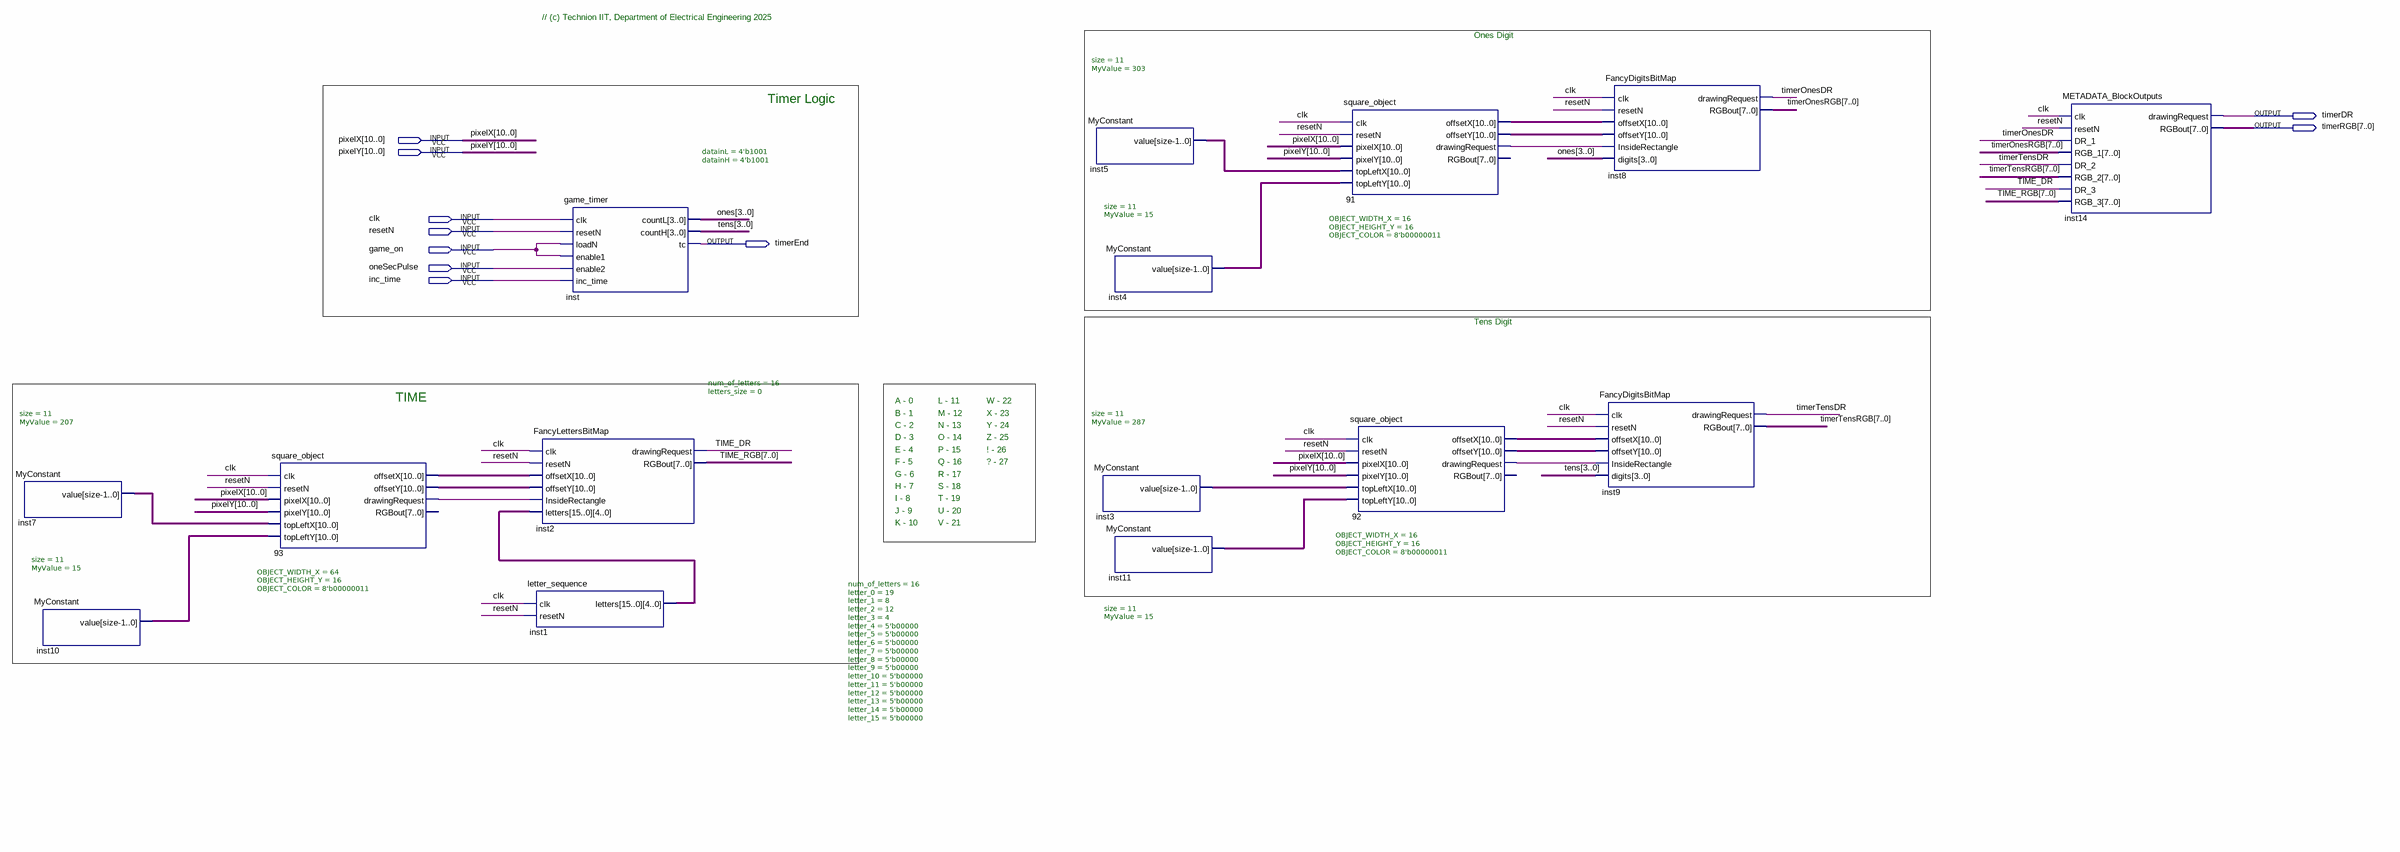
[diagram p0: schematic sheet]
// Quartus schematic Timer_Block.bdf as structural Verilog: 15 symbols, 10 pins
module Timer_Block (
  input  [10:0] pixelX,
  input  [10:0] pixelY,
  input  clk,
  input  resetN,
  input  game_on,
  input  oneSecPulse,
  input  inc_time,
  output timerDR,
  output [7:0] timerRGB,
  output timerEnd
);

  wire n91_drawingrequest, n92_drawingrequest, n93_drawingrequest, TIME_DR, timerOnesDR, timerTensDR;
  wire [3:0] ones, tens;
  wire [7:0] TIME_RGB, timerOnesRGB, timerTensRGB;
  wire [10:0] inst3_value, inst4_value, inst5_value, inst7_value, inst10_value, inst11_value, n91_offsetx,
       n91_offsety, n92_offsetx, n92_offsety, n93_offsetx, n93_offsety;
  wire [79:0] inst1_letters;

  MyConstant #(.size(11), .MyValue(207)) inst7 (.value(inst7_value));
  MyConstant #(.size(11), .MyValue(15)) inst10 (.value(inst10_value));
  square_object #(.OBJECT_WIDTH_X(64), .OBJECT_HEIGHT_Y(16), .OBJECT_COLOR(8'b00000011)) u_93 (
    .clk(clk), .resetN(resetN), .pixelX(pixelX), .pixelY(pixelY), .topLeftX(inst7_value),
    .topLeftY(inst10_value), .offsetX(n93_offsetx), .offsetY(n93_offsety), .drawingRequest(n93_drawingrequest));  // open: RGBout
  FancyLettersBitMap #(.num_of_letters(16), .letters_size(0)) inst2 (
    .clk(clk), .resetN(resetN), .offsetX(n93_offsetx), .offsetY(n93_offsety),
    .InsideRectangle(n93_drawingrequest), .letters(inst1_letters), .drawingRequest(TIME_DR), .RGBout(TIME_RGB));
  letter_sequence #(.num_of_letters(16), .letter_0(19), .letter_1(8), .letter_2(12), .letter_3(4), .letter_4(5'b00000), .letter_5(5'b00000), .letter_6(5'b00000), .letter_7(5'b00000), .letter_8(5'b00000), .letter_9(5'b00000), .letter_10(5'b00000), .letter_11(5'b00000), .letter_12(5'b00000), .letter_13(5'b00000), .letter_14(5'b00000), .letter_15(5'b00000)) inst1 (
    .clk(clk), .resetN(resetN), .letters(inst1_letters));
  game_timer #(.datainL(4'b1001), .datainH(4'b1001)) inst (
    .clk(clk), .resetN(resetN), .loadN(game_on), .enable1(game_on), .enable2(oneSecPulse),
    .inc_time(inc_time), .countL(ones), .countH(tens), .tc(timerEnd));
  MyConstant #(.size(11), .MyValue(303)) inst5 (.value(inst5_value));
  MyConstant #(.size(11), .MyValue(287)) inst3 (.value(inst3_value));
  MyConstant #(.size(11), .MyValue(15)) inst4 (.value(inst4_value));
  MyConstant #(.size(11), .MyValue(15)) inst11 (.value(inst11_value));
  square_object #(.OBJECT_WIDTH_X(16), .OBJECT_HEIGHT_Y(16), .OBJECT_COLOR(8'b00000011)) u_91 (
    .clk(clk), .resetN(resetN), .pixelX(pixelX), .pixelY(pixelY), .topLeftX(inst5_value),
    .topLeftY(inst4_value), .offsetX(n91_offsetx), .offsetY(n91_offsety), .drawingRequest(n91_drawingrequest));  // open: RGBout
  square_object #(.OBJECT_WIDTH_X(16), .OBJECT_HEIGHT_Y(16), .OBJECT_COLOR(8'b00000011)) u_92 (
    .clk(clk), .resetN(resetN), .pixelX(pixelX), .pixelY(pixelY), .topLeftX(inst3_value),
    .topLeftY(inst11_value), .offsetX(n92_offsetx), .offsetY(n92_offsety), .drawingRequest(n92_drawingrequest));  // open: RGBout
  FancyDigitsBitMap inst8 (
    .clk(clk), .resetN(resetN), .offsetX(n91_offsetx), .offsetY(n91_offsety),
    .InsideRectangle(n91_drawingrequest), .digits(ones), .drawingRequest(timerOnesDR), .RGBout(timerOnesRGB));
  FancyDigitsBitMap inst9 (
    .clk(clk), .resetN(resetN), .offsetX(n92_offsetx), .offsetY(n92_offsety),
    .InsideRectangle(n92_drawingrequest), .digits(tens), .drawingRequest(timerTensDR), .RGBout(timerTensRGB));
  METADATA_BlockOutputs inst14 (
    .clk(clk), .resetN(resetN), .DR_1(timerOnesDR), .RGB_1(timerOnesRGB), .DR_2(timerTensDR),
    .RGB_2(timerTensRGB), .DR_3(TIME_DR), .RGB_3(TIME_RGB), .drawingRequest(timerDR), .RGBout(timerRGB));

  // Notes on the sheet:
  //   // (c) Technion IIT, Department of Electrical Engineering 2025
  //   Ones Digit 
  //   Timer Logic
  //   Tens Digit 
  //   TIME
  //   A - 0
  //   L - 11
  //   W - 22
  //   B - 1
  //   M - 12
  //   X - 23
  //   C - 2
  //   N - 13
  //   Y - 24
  //   D - 3
  //   O - 14
  //   Z - 25
  //   E - 4
  //   P - 15
  //   ! - 26
  //   F - 5
  //   Q - 16
  //   ? - 27
  //   G - 6
  //   R - 17
  //   H - 7
  //   S - 18
  //   I - 8
  //   T - 19
  //   J - 9
  //   U - 20
  //   K - 10
  //   V - 21
endmodule
